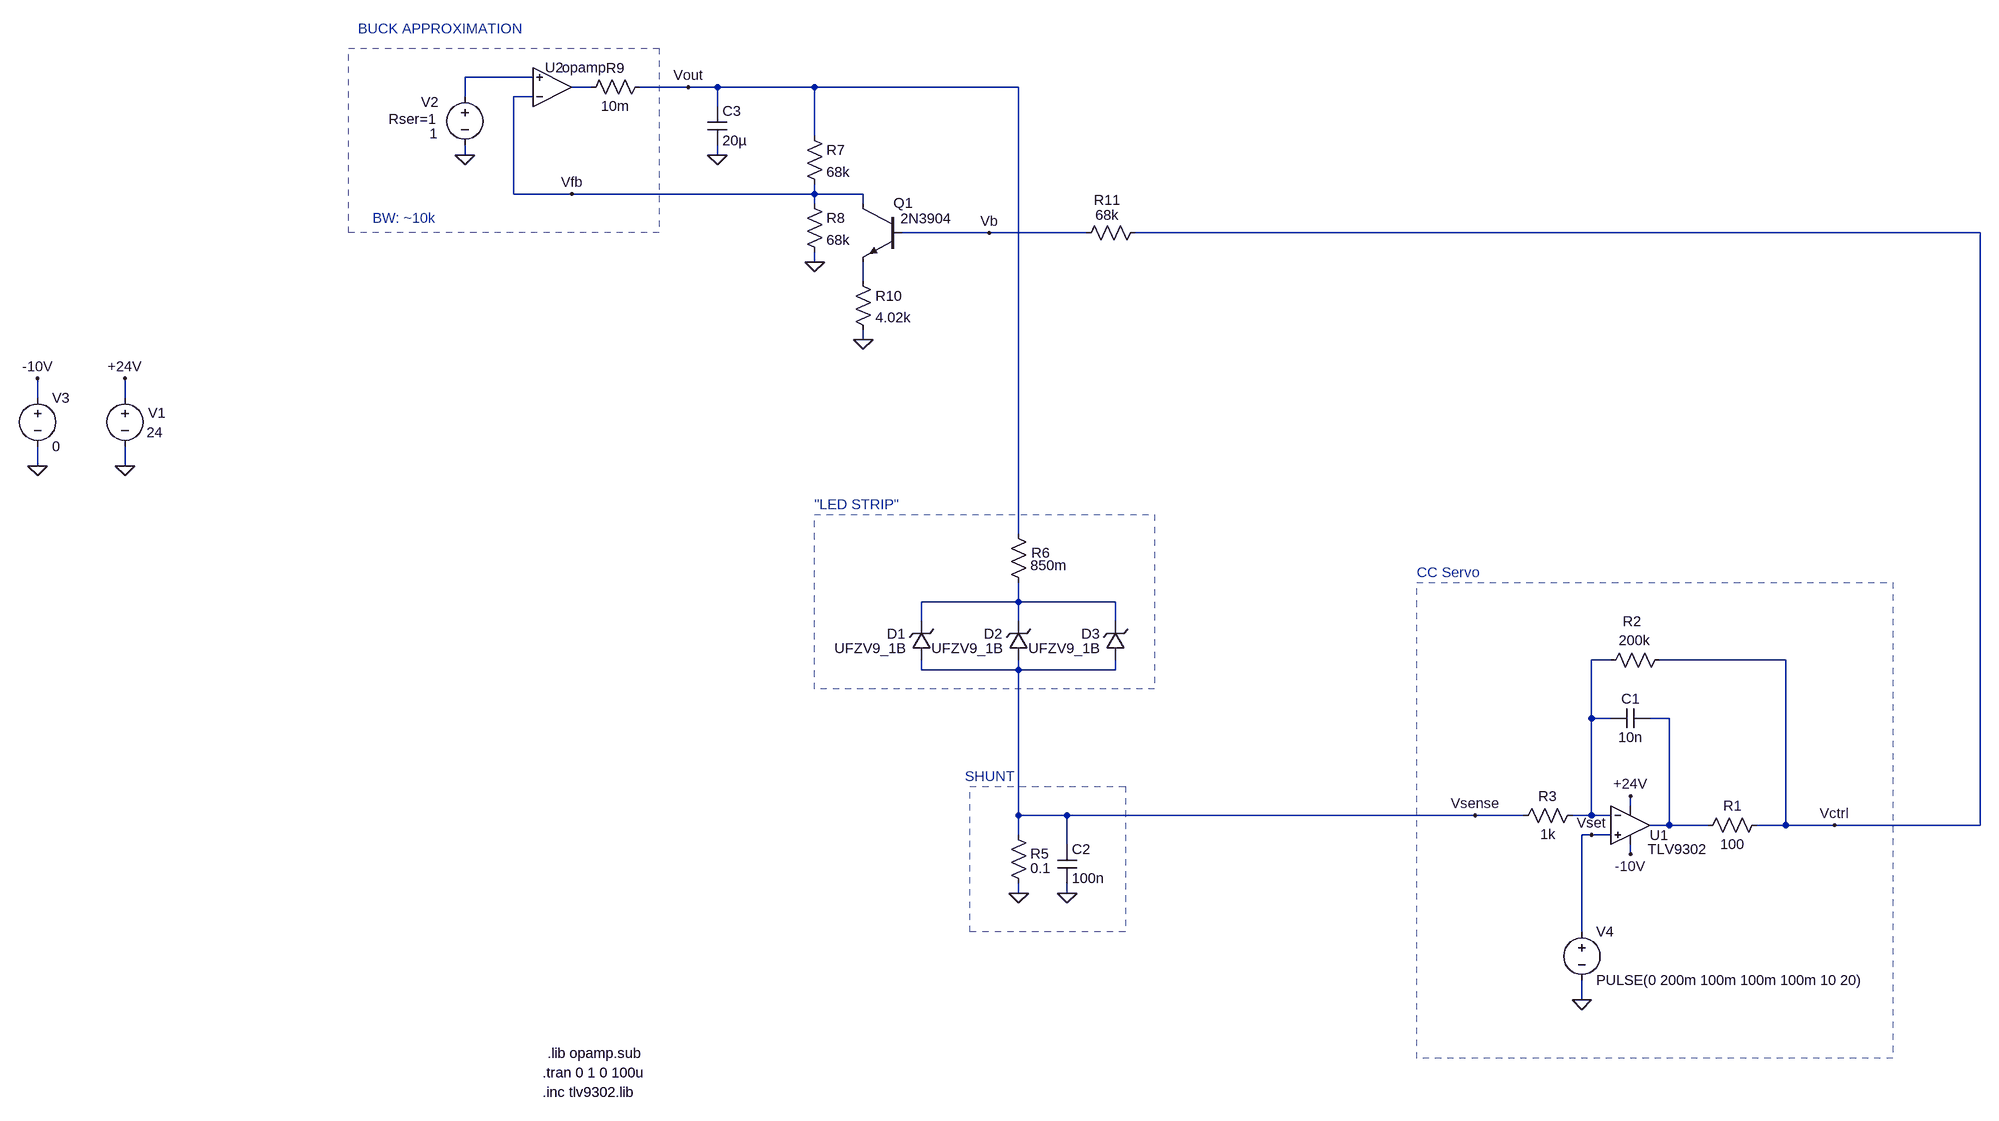
[diagram p0: schematic cc_servo.asc]
cc_servo.asc, the LTspice schematic file:
Version 4
SHEET 1 1656 680
WIRE -976 -1232 -1088 -1232
WIRE -880 -1216 -912 -1216
WIRE -720 -1216 -800 -1216
WIRE -672 -1216 -720 -1216
WIRE -512 -1216 -672 -1216
WIRE -176 -1216 -512 -1216
WIRE -1088 -1200 -1088 -1232
WIRE -976 -1200 -1008 -1200
WIRE -672 -1184 -672 -1216
WIRE -512 -1136 -512 -1216
WIRE -1088 -1104 -1088 -1120
WIRE -672 -1104 -672 -1120
WIRE -1008 -1040 -1008 -1200
WIRE -912 -1040 -1008 -1040
WIRE -512 -1040 -512 -1056
WIRE -512 -1040 -912 -1040
WIRE -432 -1040 -512 -1040
WIRE -512 -1024 -512 -1040
WIRE -432 -1024 -432 -1040
WIRE -224 -976 -368 -976
WIRE -64 -976 -224 -976
WIRE 1408 -976 16 -976
WIRE -512 -928 -512 -944
WIRE -432 -896 -432 -928
WIRE -432 -800 -432 -816
WIRE -1792 -704 -1792 -736
WIRE -1648 -704 -1648 -736
WIRE -1792 -592 -1792 -624
WIRE -1648 -592 -1648 -624
WIRE -176 -480 -176 -1216
WIRE -176 -368 -176 -400
WIRE -176 -368 -336 -368
WIRE -16 -368 -176 -368
WIRE -336 -336 -336 -368
WIRE -176 -336 -176 -368
WIRE -16 -336 -16 -368
WIRE 800 -272 768 -272
WIRE 1088 -272 880 -272
WIRE -336 -256 -336 -272
WIRE -176 -256 -176 -272
WIRE -176 -256 -336 -256
WIRE -16 -256 -16 -272
WIRE -16 -256 -176 -256
WIRE 768 -176 768 -272
WIRE 800 -176 768 -176
WIRE 896 -176 864 -176
WIRE 832 -32 832 -48
WIRE -176 -16 -176 -256
WIRE -96 -16 -176 -16
WIRE 576 -16 -96 -16
WIRE 656 -16 576 -16
WIRE 768 -16 768 -176
WIRE 768 -16 736 -16
WIRE 800 -16 768 -16
WIRE 896 0 896 -176
WIRE 896 0 864 0
WIRE 960 0 896 0
WIRE 1088 0 1088 -272
WIRE 1088 0 1040 0
WIRE 1168 0 1088 0
WIRE 1408 0 1408 -976
WIRE 1408 0 1168 0
WIRE -176 16 -176 -16
WIRE 768 16 752 16
WIRE 800 16 768 16
WIRE -96 32 -96 -16
WIRE 832 48 832 32
WIRE -176 112 -176 96
WIRE -96 112 -96 96
WIRE 752 176 752 16
WIRE 752 288 752 256
FLAG -1648 -736 +24V
FLAG -1648 -592 0
FLAG 832 -48 +24V
FLAG -1792 -592 0
FLAG -1792 -736 -10V
FLAG 832 48 -10V
FLAG 1168 0 Vctrl
FLAG 576 -16 Vsense
FLAG 752 288 0
FLAG 768 16 Vset
FLAG -176 112 0
FLAG -96 112 0
FLAG -1088 -1104 0
FLAG -512 -928 0
FLAG -672 -1104 0
FLAG -720 -1216 Vout
FLAG -912 -1040 Vfb
FLAG -432 -800 0
FLAG -224 -976 Vb
SYMBOL OpAmps\\opamp2 832 -64 R0
WINDOW 0 32 81 Left 2
WINDOW 3 29 104 Left 2
SYMATTR InstName U1
SYMATTR Value TLV9302
SYMBOL voltage -1648 -720 R0
WINDOW 0 38 41 Left 2
WINDOW 3 36 73 Left 2
WINDOW 123 0 0 Left 0
WINDOW 39 0 0 Left 0
SYMATTR InstName V1
SYMATTR Value 24
SYMBOL cap 864 -192 R90
WINDOW 0 0 32 VBottom 2
WINDOW 3 32 32 VTop 2
SYMATTR InstName C1
SYMATTR Value 10n
SYMBOL res 1056 -16 R90
WINDOW 0 0 56 VBottom 2
WINDOW 3 32 56 VTop 2
SYMATTR InstName R1
SYMATTR Value 100
SYMBOL res 896 -288 R90
WINDOW 0 -32 61 VBottom 2
WINDOW 3 -32 57 VTop 2
SYMATTR InstName R2
SYMATTR Value 200k
SYMBOL voltage -1792 -720 R0
WINDOW 123 0 0 Left 0
WINDOW 39 0 0 Left 0
SYMATTR InstName V3
SYMATTR Value 0
SYMBOL res 752 -32 R90
WINDOW 0 0 56 VBottom 2
WINDOW 3 32 56 VTop 2
SYMATTR InstName R3
SYMATTR Value 1k
SYMBOL voltage 752 160 R0
WINDOW 123 0 0 Left 0
WINDOW 39 0 0 Left 0
SYMATTR InstName V4
SYMATTR Value PULSE(0 200m 100m 100m 100m 10 20)
SYMBOL res -192 0 R0
WINDOW 0 36 47 Left 2
WINDOW 3 36 71 Left 2
SYMATTR InstName R5
SYMATTR Value 0.1
SYMBOL cap -112 32 R0
SYMATTR InstName C2
SYMATTR Value 100n
SYMBOL OpAmps\\opamp -944 -1152 M180
WINDOW 0 -12 96 Left 2
SYMATTR InstName U2
SYMATTR SpiceLine2 GBW=10k
SYMBOL zener -320 -272 R180
WINDOW 0 42 43 Left 2
WINDOW 3 40 19 Left 2
SYMATTR InstName D1
SYMATTR Value UFZV9_1B
SYMATTR Description Diode
SYMATTR Type diode
SYMBOL res -192 -496 R0
WINDOW 0 37 48 Left 2
WINDOW 3 36 68 Left 2
SYMATTR InstName R6
SYMATTR Value 850m
SYMBOL voltage -1088 -1216 R0
WINDOW 0 -72 25 Left 2
WINDOW 3 -58 77 Left 2
WINDOW 123 0 0 Left 0
WINDOW 39 -126 53 Left 2
SYMATTR InstName V2
SYMATTR Value 1
SYMATTR SpiceLine Rser=1
SYMBOL res -528 -1152 R0
SYMATTR InstName R7
SYMATTR Value 68k
SYMBOL res -528 -1040 R0
SYMATTR InstName R8
SYMATTR Value 68k
SYMBOL res -784 -1232 R90
WINDOW 0 0 56 VBottom 2
WINDOW 3 32 56 VTop 2
SYMATTR InstName R9
SYMATTR Value 10m
SYMBOL cap -688 -1184 R0
SYMATTR InstName C3
SYMATTR Value 20µ
SYMBOL zener -160 -272 R180
WINDOW 0 42 43 Left 2
WINDOW 3 40 19 Left 2
SYMATTR InstName D2
SYMATTR Value UFZV9_1B
SYMATTR Description Diode
SYMATTR Type diode
SYMBOL zener 0 -272 R180
WINDOW 0 42 43 Left 2
WINDOW 3 40 19 Left 2
SYMATTR InstName D3
SYMATTR Value UFZV9_1B
SYMATTR Description Diode
SYMATTR Type diode
SYMBOL npn -368 -1024 M0
WINDOW 0 -18 -1 Left 2
WINDOW 3 -82 25 Left 2
SYMATTR InstName Q1
SYMATTR Value 2N3904
SYMBOL res -448 -912 R0
SYMATTR InstName R10
SYMATTR Value 4.02k
SYMBOL res 32 -992 R90
WINDOW 0 -22 62 VBottom 2
WINDOW 3 -29 62 VTop 2
SYMATTR InstName R11
SYMATTR Value 68k
TEXT -960 440 Left 2 !.inc tlv9302.lib
TEXT -960 408 Left 2 !.tran 0 1 0 100u
TEXT -1264 -1312 Left 2 ;BUCK APPROXIMATION
TEXT -512 -528 Left 2 ;"LED STRIP"
TEXT -952 376 Left 2 !.lib opamp.sub
TEXT -264 -80 Left 2 ;SHUNT
TEXT 480 -416 Left 2 ;CC Servo
TEXT -1240 -1000 Left 2 ;BW: ~10k
RECTANGLE Normal 48 -224 -512 -512 2
RECTANGLE Normal 0 176 -256 -64 2
RECTANGLE Normal 1264 384 480 -400 2
RECTANGLE Normal -768 -976 -1280 -1280 2

The netlist it stands for:
* cc_servo.asc
XU1 Vset N005 +24V -10V N006 TLV9302  ; pins In+ In- V+ V- OUT
V1 +24V 0 24
C1 N006 N005 10n
R1 Vctrl N006 100
R2 Vctrl N005 200k
V3 -10V 0 0
R3 N005 Vsense 1k
V4 Vset 0 PULSE(0 200m 100m 100m 100m 10 20)
R5 Vsense 0 0.1
C2 Vsense 0 100n
XU2 Vfb N001 N002 opamp Aol=100K GBW=10k  ; pins invin noninvin out
D1 Vsense N004 UFZV9_1B
R6 Vout N004 850m
V2 N001 0 1 Rser=1
R7 Vout Vfb 68k
R8 Vfb 0 68k
R9 Vout N002 10m
C3 Vout 0 20µ
D2 Vsense N004 UFZV9_1B
D3 Vsense N004 UFZV9_1B
Q1 Vfb Vb N003 0 2N3904
R10 N003 0 4.02k
R11 Vctrl Vb 68k
.model D D
.lib standard.dio
.model NPN NPN
.model PNP PNP
.lib standard.bjt
.inc tlv9302.lib
.tran 0 1 0 100u
* BUCK APPROXIMATION
* "LED STRIP"
.lib opamp.sub
* SHUNT
* CC Servo
* BW: ~10k
.backanno
.end